# Altium project TDII_PROYECT_R00.PrjPcb
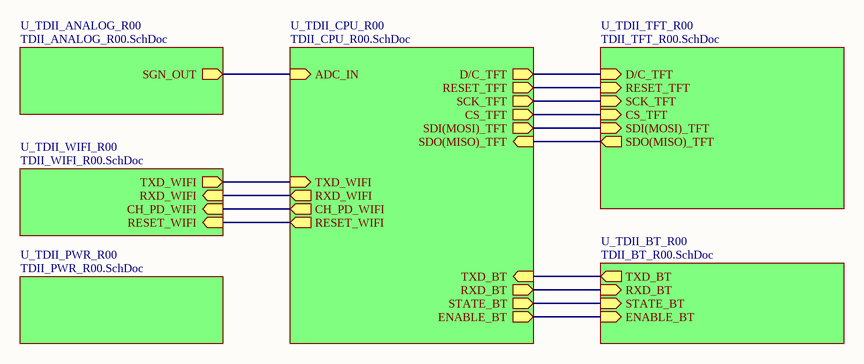
[diagram p0: TDII_Bloques_R00.SchDoc]
7 sheets, 73 parts. Net scope: hierarchical (ports join the sheet entries above them; power ports are global).
Board file: TDII_PCB_R00.PcbDoc
Sheets:
  TDII_Bloques_R00.SchDoc
    U_TDII_ANALOG_R00 = TDII_ANALOG_R00.SchDoc
    U_TDII_BT_R00 = TDII_BT_R00.SchDoc
    U_TDII_TFT_R00 = TDII_TFT_R00.SchDoc
    U_TDII_WIFI_R00 = TDII_WIFI_R00.SchDoc
    U_TDII_CPU_R00 = TDII_CPU_R00.SchDoc
    U_TDII_PWR_R00 = TDII_PWR_R00.SchDoc

## Sheet TDII_Bloques_R00.SchDoc
size A4

### Sub-sheets
U_TDII_ANALOG_R00 = TDII_ANALOG_R00.SchDoc: SGN_OUT (out)
U_TDII_BT_R00 = TDII_BT_R00.SchDoc: STATE_BT (in), RXD_BT (in), TXD_BT (out), ENABLE_BT (in)
U_TDII_CPU_R00 = TDII_CPU_R00.SchDoc: SCK_TFT (out), D/C_TFT (out), RESET_TFT (out), CS_TFT (out), SDO(MISO)_TFT (in), SDI(MOSI)_TFT (out), TXD_WIFI (in), RXD_WIFI (out), CH_PD_WIFI (out), RESET_WIFI (out), STATE_BT (out), TXD_BT (in), RXD_BT (out), ENABLE_BT (out), ADC_IN (in)
U_TDII_PWR_R00 = TDII_PWR_R00.SchDoc: no entries
U_TDII_TFT_R00 = TDII_TFT_R00.SchDoc: D/C_TFT (in), RESET_TFT (in), SCK_TFT (in), CS_TFT (in), SDO(MISO)_TFT (out), SDI(MOSI)_TFT (in)
U_TDII_WIFI_R00 = TDII_WIFI_R00.SchDoc: RXD_WIFI (in), TXD_WIFI (out), CH_PD_WIFI (in), RESET_WIFI (in)

### Nets
CS: sheet U_TDII_TFT_R00/CS_TFT, sheet U_TDII_CPU_R00/CS_TFT
D/C: sheet U_TDII_TFT_R00/D/C_TFT, sheet U_TDII_CPU_R00/D/C_TFT
MISO: sheet U_TDII_TFT_R00/SDO(MISO)_TFT, sheet U_TDII_CPU_R00/SDO(MISO)_TFT
MOSI: sheet U_TDII_TFT_R00/SDI(MOSI)_TFT, sheet U_TDII_CPU_R00/SDI(MOSI)_TFT
RESET: sheet U_TDII_TFT_R00/RESET_TFT, sheet U_TDII_CPU_R00/RESET_TFT
RX2_BT: sheet U_TDII_BT_R00/RXD_BT, sheet U_TDII_CPU_R00/RXD_BT
RX2_CPU: sheet U_TDII_WIFI_R00/TXD_WIFI, sheet U_TDII_CPU_R00/TXD_WIFI
RX2_WIFI: sheet U_TDII_WIFI_R00/RXD_WIFI, sheet U_TDII_CPU_R00/RXD_WIFI
RX3_CPU: sheet U_TDII_BT_R00/TXD_BT, sheet U_TDII_CPU_R00/TXD_BT
SCK: sheet U_TDII_TFT_R00/SCK_TFT, sheet U_TDII_CPU_R00/SCK_TFT
NetJ2_1: sheet U_TDII_BT_R00/ENABLE_BT, sheet U_TDII_CPU_R00/ENABLE_BT
NetJ2_6: sheet U_TDII_BT_R00/STATE_BT, sheet U_TDII_CPU_R00/STATE_BT
NetJ8_2: sheet U_TDII_WIFI_R00/CH_PD_WIFI, sheet U_TDII_CPU_R00/CH_PD_WIFI
NetJ8_3: sheet U_TDII_WIFI_R00/RESET_WIFI, sheet U_TDII_CPU_R00/RESET_WIFI
NetU2_1: sheet U_TDII_ANALOG_R00/SGN_OUT, sheet U_TDII_CPU_R00/ADC_IN

## Sheet TDII_ANALOG_R00.SchDoc
size A4
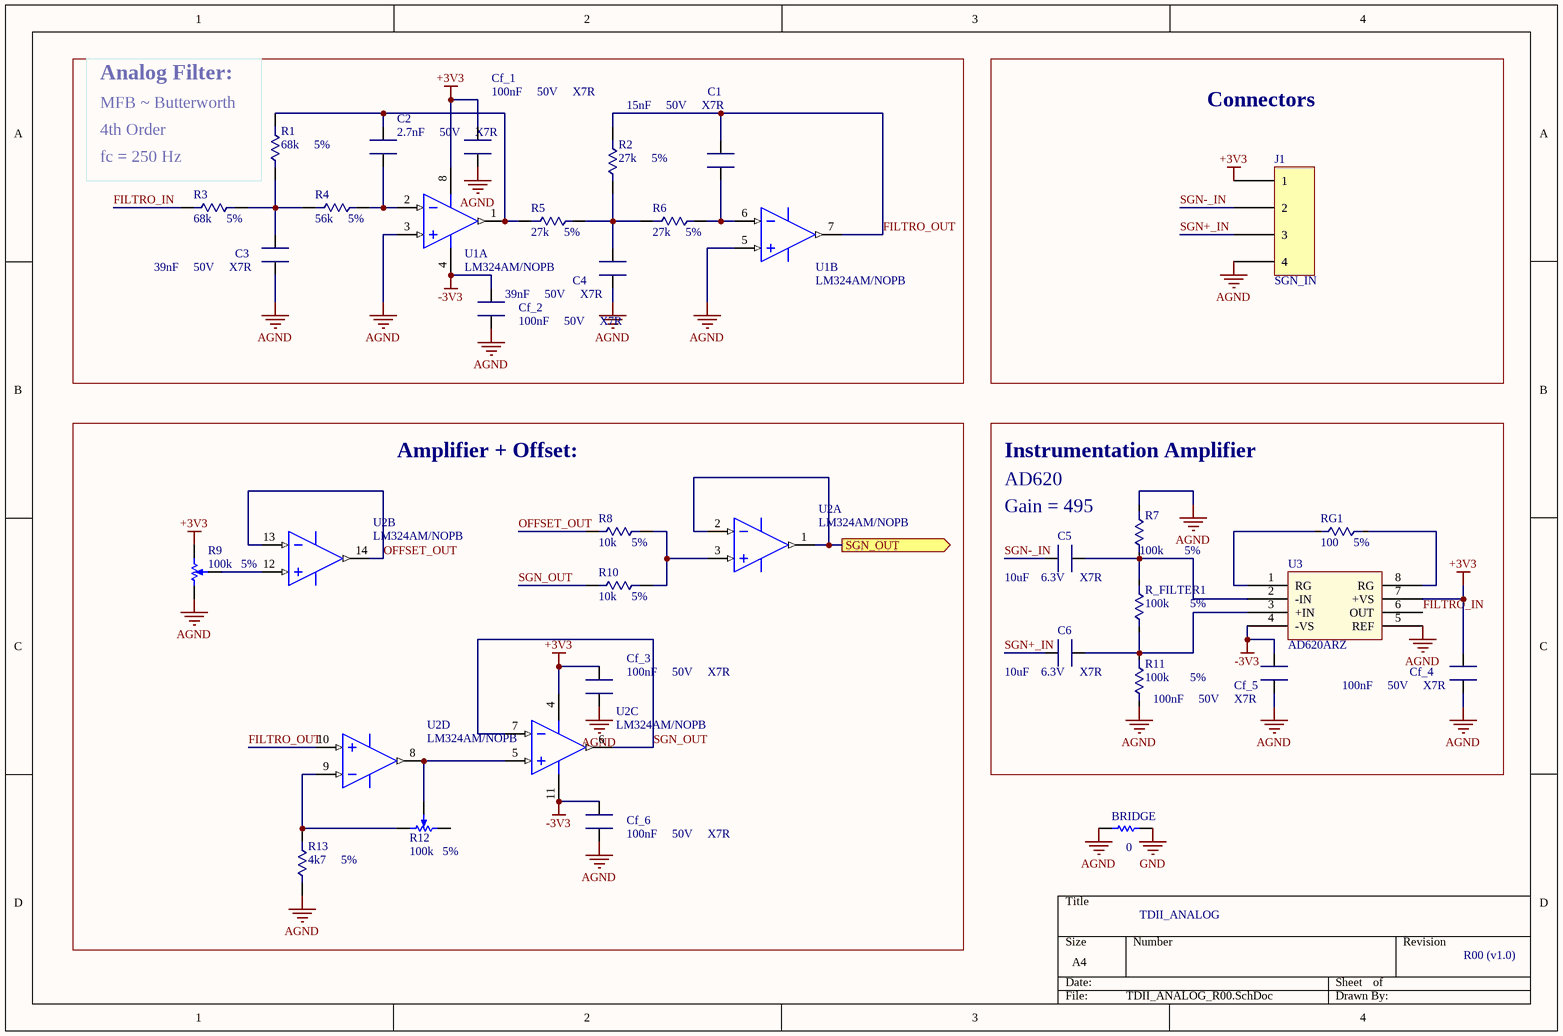
[diagram p1: TDII_ANALOG_R00.SchDoc]

### Parts
BRIDGE  value 0  [R_0805]  (hidden comment: Res1)
C1  15nF     50V     X7R  [C_0805]
C2  2.7nF     50V     X7R  [C_0805]
C3  39nF     50V     X7R  [C_0805]
C4  39nF     50V     X7R  [C_0805]
C5  10uF    6.3V     X7R  [C_0805]
C6  10uF    6.3V     X7R  [C_0805]
Cf_1  100nF     50V     X7R  [C_0805]
Cf_2  100nF     50V     X7R  [C_0805]
Cf_3  100nF     50V     X7R  [C_0805]
Cf_4  100nF     50V     X7R  [C_0805]
Cf_5  100nF     50V     X7R  [C_0805]
Cf_6  100nF     50V     X7R  [C_0805]
J1  SGN_IN  [HEADER_1X4]
R1  68k     5%  [R_0805]
R2  27k     5%  [R_0805]
R3  68k     5%  [R_0805]
R4  56k     5%  [R_0805]
R5  27k     5%  [R_0805]
R6  27k     5%  [R_0805]
R7  100k       5%  [R_0805]
R8  10k     5%  [R_0805]
R9  100k   5%  [Preset]
R10  10k     5%  [R_0805]
R11  100k       5%  [R_0805]
R12  100k   5%  [Preset]
R13  4k7     5%  [R_0805]
R_FILTER1  100k       5%  [R_0805]
RG1  100     5%  [R_0805]
U1  LM324AM/NOPB  [SOI8]  (parts A,B of 2)
U2  LM324AM/NOPB  [SOIC14]  (parts A,B,C,D of 4)
U3  AD620ARZ  [SOI8]

### Blocks framed on the sheet
Analog Filter:: C1-C4 Cf_1 Cf_2 R1-R6 U1
Connectors: J1
Amplifier + Offset:: Cf_3 Cf_6 R8-R10 R12 R13 U2
Instrumentation Amplifier: C5 C6 Cf_4 Cf_5 R7 R11 R_FILTER1 RG1 U3

### Ports
SGN_OUT (out)

### Nets
+3V3: Cf_1.2 Cf_3.2 Cf_4.2 J1.1 R9.2 U1.8(V+) U2.4(V+) U3.7(+VS)
-3V3: Cf_2.2 Cf_5.1 Cf_6.2 U1.4(GND) U2.11(GND) U3.4(-VS)
AGND: BRIDGE.1 C3.1 C4.1 Cf_1.1 Cf_2.1 Cf_3.1 Cf_4.1 Cf_5.2 Cf_6.1 J1.4 R7.2 R9.1 R11.1 R13.1 U1.3(INA+) U1.5(INB+) U3.5(REF)
GND: BRIDGE.2
FILTRO_IN: R3.1 U3.6(OUT)
FILTRO_OUT: C1.2 R2.2 U1.7(OUTB) U2.10(IN3+)
OFFSET_OUT: R8.1 U2.13(IN4-) U2.14(OUT4)
SGN+_IN: C6.1 J1.3
SGN-_IN: C5.1 J1.2
SGN_OUT: R10.1 U2.6(IN2-) U2.7(OUT2)
NetC1_1: C1.1 R6.1 U1.6(INB-)
NetC2_1: C2.1 R4.1 U1.2(INA-)
NetC2_2: C2.2 R1.2 R5.2 U1.1(OUTA)
NetC3_2: C3.2 R1.1 R3.2 R4.2
NetC4_2: C4.2 R2.1 R5.1 R6.2
NetC5_2: C5.2 R7.1 R_FILTER1.2 U3.2(-IN)
NetC6_2: C6.2 R11.2 R_FILTER1.1 U3.3(+IN)
NetR8_2: R8.2 R10.2 U2.3(IN1+)
NetR9_3: R9.3 U2.12(IN4+)
NetR12_1: R12.1 R13.2 U2.9(IN3-)
NetR12_3: R12.3 U2.5(IN2+) U2.8(OUT3)
NetRG1_1: RG1.1 U3.1(RG)
NetRG1_2: RG1.2 U3.8(RG)
NetU2_1: U2.1(OUT1) U2.2(IN1-) ; port SGN_OUT

Not connected (* = marked no-connect by the designer): R12 2

### Notes on the sheet
- (near R1) MFB ~ Butterworth
- 4th Order
- (near R3) fc = 250 Hz
- Gain = 495
- AD620
- TDII_ANALOG
- R00 (v1.0)

### Library data of the parts
BRIDGE = Res1: Resistor; Published: 8-Jun-2000; LatestRevisionDate: 17-Jul-2002; LatestRevisionNote: Re-released for DXP Platform.; PackageReference: AXIAL-0.3; Publisher: Altium Limited
C1-C6 Cf_1-Cf_6 = CAP
J1 = Conector_4 ( 0.100")
R1-R8 R10 R11 R13 R_FILTER1 RG1 = RES
R9 R12 = RPot SM: Square Trimming Potentiometer; Published: 17-Dec-2003; DatasheetVersion: Oct-2003; PackageReference: POT4MM-2; Publisher: Altium Limited; ComponentLink1Description: Manufacturer Link; ComponentLink1URL: http://bourns.com/2/search.html
U1 = LM358M: Low Power Dual Operational Amplifier, 8-pin Narrow SOIC; Manufacturer: National Semiconductor; PackageTopMarking: NSZXTT*LM*358M; PowerWise: N; CompType: Amplifiers; High-Reliability: Y; DatasheetVersion: Oct-2005; PackageVersion: revM, May-2009; PackageReference: M08A; PackageDescription: SOIC Narrow, 4.9 x 3.9 x 1.45mm, 8 Lead, 1.27mm Pitch; PartNumber: LM358M; RoHS: N; PinCount: 8; Code_JEDEC: MS-012-AA; Code_IPC: SOIC127P600-8; ComponentLink1Description: Manufacturer URL; ComponentLink1URL: http://www.national.com/; ComponentLink2Description: LM358 Datasheet; ComponentLink2URL: http://www.national.com/ds/LM/LM358.pdf; ComponentLink3Description: LM358 Web Page; ComponentLink3URL: http://www.national.com/pf/LM/LM358.html; ComponentLink4Description: M08A Package Page; ComponentLink4URL: http://www.national.com/packaging/folders/m08a.html; Digi-Key Part Number: LM358MXFSCT-ND
U2 = LM324M: Low Power Quad Operational Amplifier, 14-pin Narrow SOIC; Manufacturer: National Semiconductor; PackageTopMarking: NSUZXYTTE#*LM324M; PowerWise: N; CompType: Amplifiers; High-Reliability: Y; DatasheetVersion: Aug-2000; PackageVersion: revJ, Jan-1996; PackageReference: M14A; PackageDescription: Molded Package S.O., .150in Wide, 14 Lead; PartNumber: LM324M; RoHS: N; PinCount: 14; Code_JEDEC: MS-012AB; Code_IPC: SOIC127P600-14; ComponentLink1Description: Manufacturer URL; ComponentLink1URL: http://www.national.com/; ComponentLink2Description: LM324 Datasheet; ComponentLink2URL: http://www.national.com/ds/LM/LM324.pdf; ComponentLink3Description: LM324 Web Page; ComponentLink3URL: http://www.national.com/pf/LM/LM324.html; ComponentLink4Description: M14A Package Page; ComponentLink4URL: http://www.national.com/packaging/folders/m14a.html
U3 = AD620: Digi-Key Part Number: AD620ARZ-REEL7TR-ND

## Sheet TDII_BT_R00.SchDoc
size A4
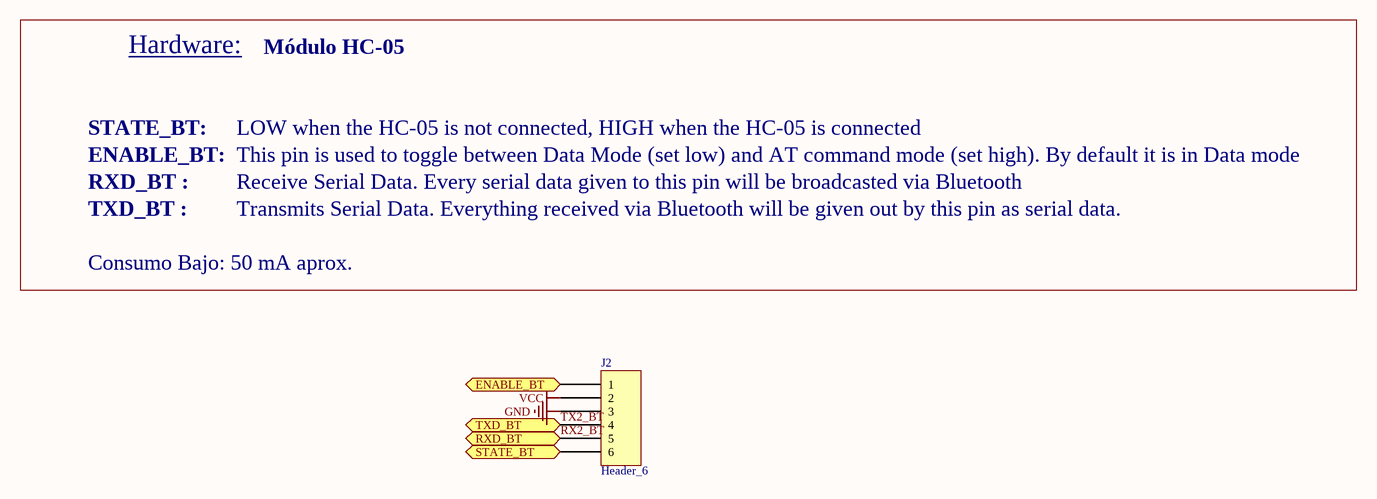
[diagram p2: TDII_BT_R00.SchDoc]

### Parts
J2  Header_6  [HEADER_1x6]

### Ports
ENABLE_BT (in), RXD_BT (out), STATE_BT (out), TXD_BT (in)

### Nets
GND: J2.3
VCC: J2.2
RX2_BT: J2.5 ; port RXD_BT
TX2_BT: J2.4 ; port TXD_BT  [project net RX3_CPU]
NetJ2_1: J2.1 ; port ENABLE_BT
NetJ2_6: J2.6 ; port STATE_BT

### Notes on the sheet
- Hardware:
- Módulo HC-05
- ENABLE_BT:
- STATE_BT:
- RXD_BT :
- LOW when the HC-05 is not connected, HIGH when the HC-05 is connected
- This pin is used to toggle between Data Mode (set low) and AT command mode (set high). By default it is in Data mode
- Receive Serial Data. Every serial data given to this pin will be broadcasted via Bluetooth
- TXD_BT :
- Transmits Serial Data. Everything received via Bluetooth will be given out by this pin as serial data.
- Consumo Bajo: 50 mA aprox.

### Library data of the parts
J2 = Conector_6 ( 0.100¨)

## Sheet TDII_TFT_R00.SchDoc
size A4
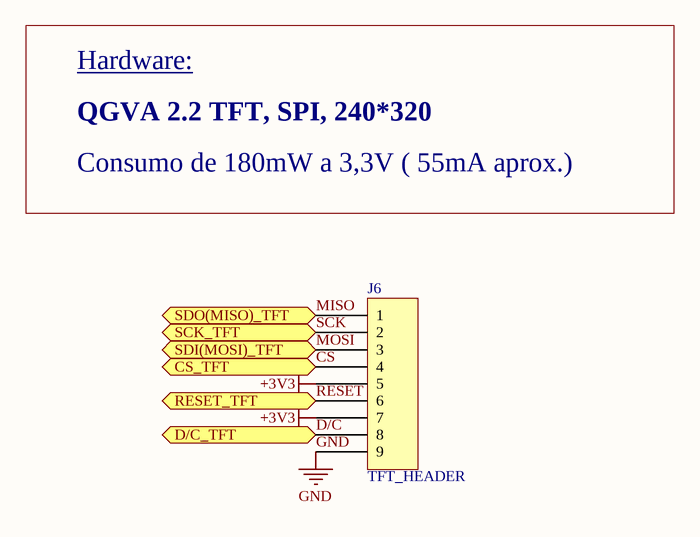
[diagram p3: TDII_TFT_R00.SchDoc]

### Parts
J6  TFT_HEADER  [Conector_TFT]

### Ports
CS_TFT (in), D/C_TFT (in), RESET_TFT (in), SCK_TFT (in), SDI(MOSI)_TFT (in), SDO(MISO)_TFT (out)

### Nets
+3V3: J6.5 J6.7
GND: J6.9
CS: J6.4 ; port CS_TFT
D/C: J6.8 ; port D/C_TFT
MISO: J6.1 ; port SDO(MISO)_TFT
MOSI: J6.3 ; port SDI(MOSI)_TFT
RESET: J6.6 ; port RESET_TFT
SCK: J6.2 ; port SCK_TFT

### Notes on the sheet
- Hardware:
- QGVA 2.2 TFT, SPI, 240*320
- Consumo de 180mW a 3,3V ( 55mA aprox.)

### Library data of the parts
J6 = Conector_9 (0.100¨)

## Sheet TDII_WIFI_R00.SchDoc
size A4
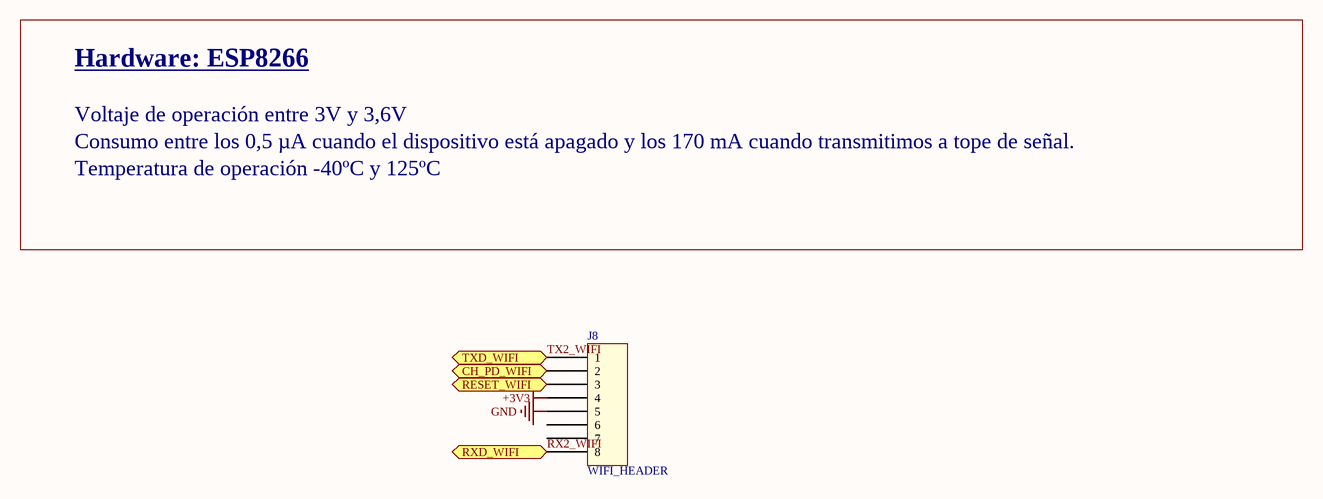
[diagram p4: TDII_WIFI_R00.SchDoc]

### Parts
J8  WIFI_HEADER  [Header_WIFI]

### Ports
CH_PD_WIFI (in), RESET_WIFI (in), RXD_WIFI (in), TXD_WIFI (out)

### Nets
+3V3: J8.4
GND: J8.5
RX2_WIFI: J8.8 ; port RXD_WIFI
TX2_WIFI: J8.1 ; port TXD_WIFI  [project net RX2_CPU]
NetJ8_2: J8.2 ; port CH_PD_WIFI
NetJ8_3: J8.3 ; port RESET_WIFI

Not connected (* = marked no-connect by the designer): J8 6 7

### Notes on the sheet
- Hardware: ESP8266
- Voltaje de operación entre 3V y 3,6V
- Consumo entre los 0,5 µA cuando el dispositivo está apagado y los 170 mA cuando transmitimos a tope de señal.
- Temperatura de operación -40ºC y 125ºC

### Library data of the parts
J8 = Conector_8 ( 0.100¨)

## Sheet TDII_CPU_R00.SchDoc: TDII_CPU_LPC
size B; Revision: R0.0
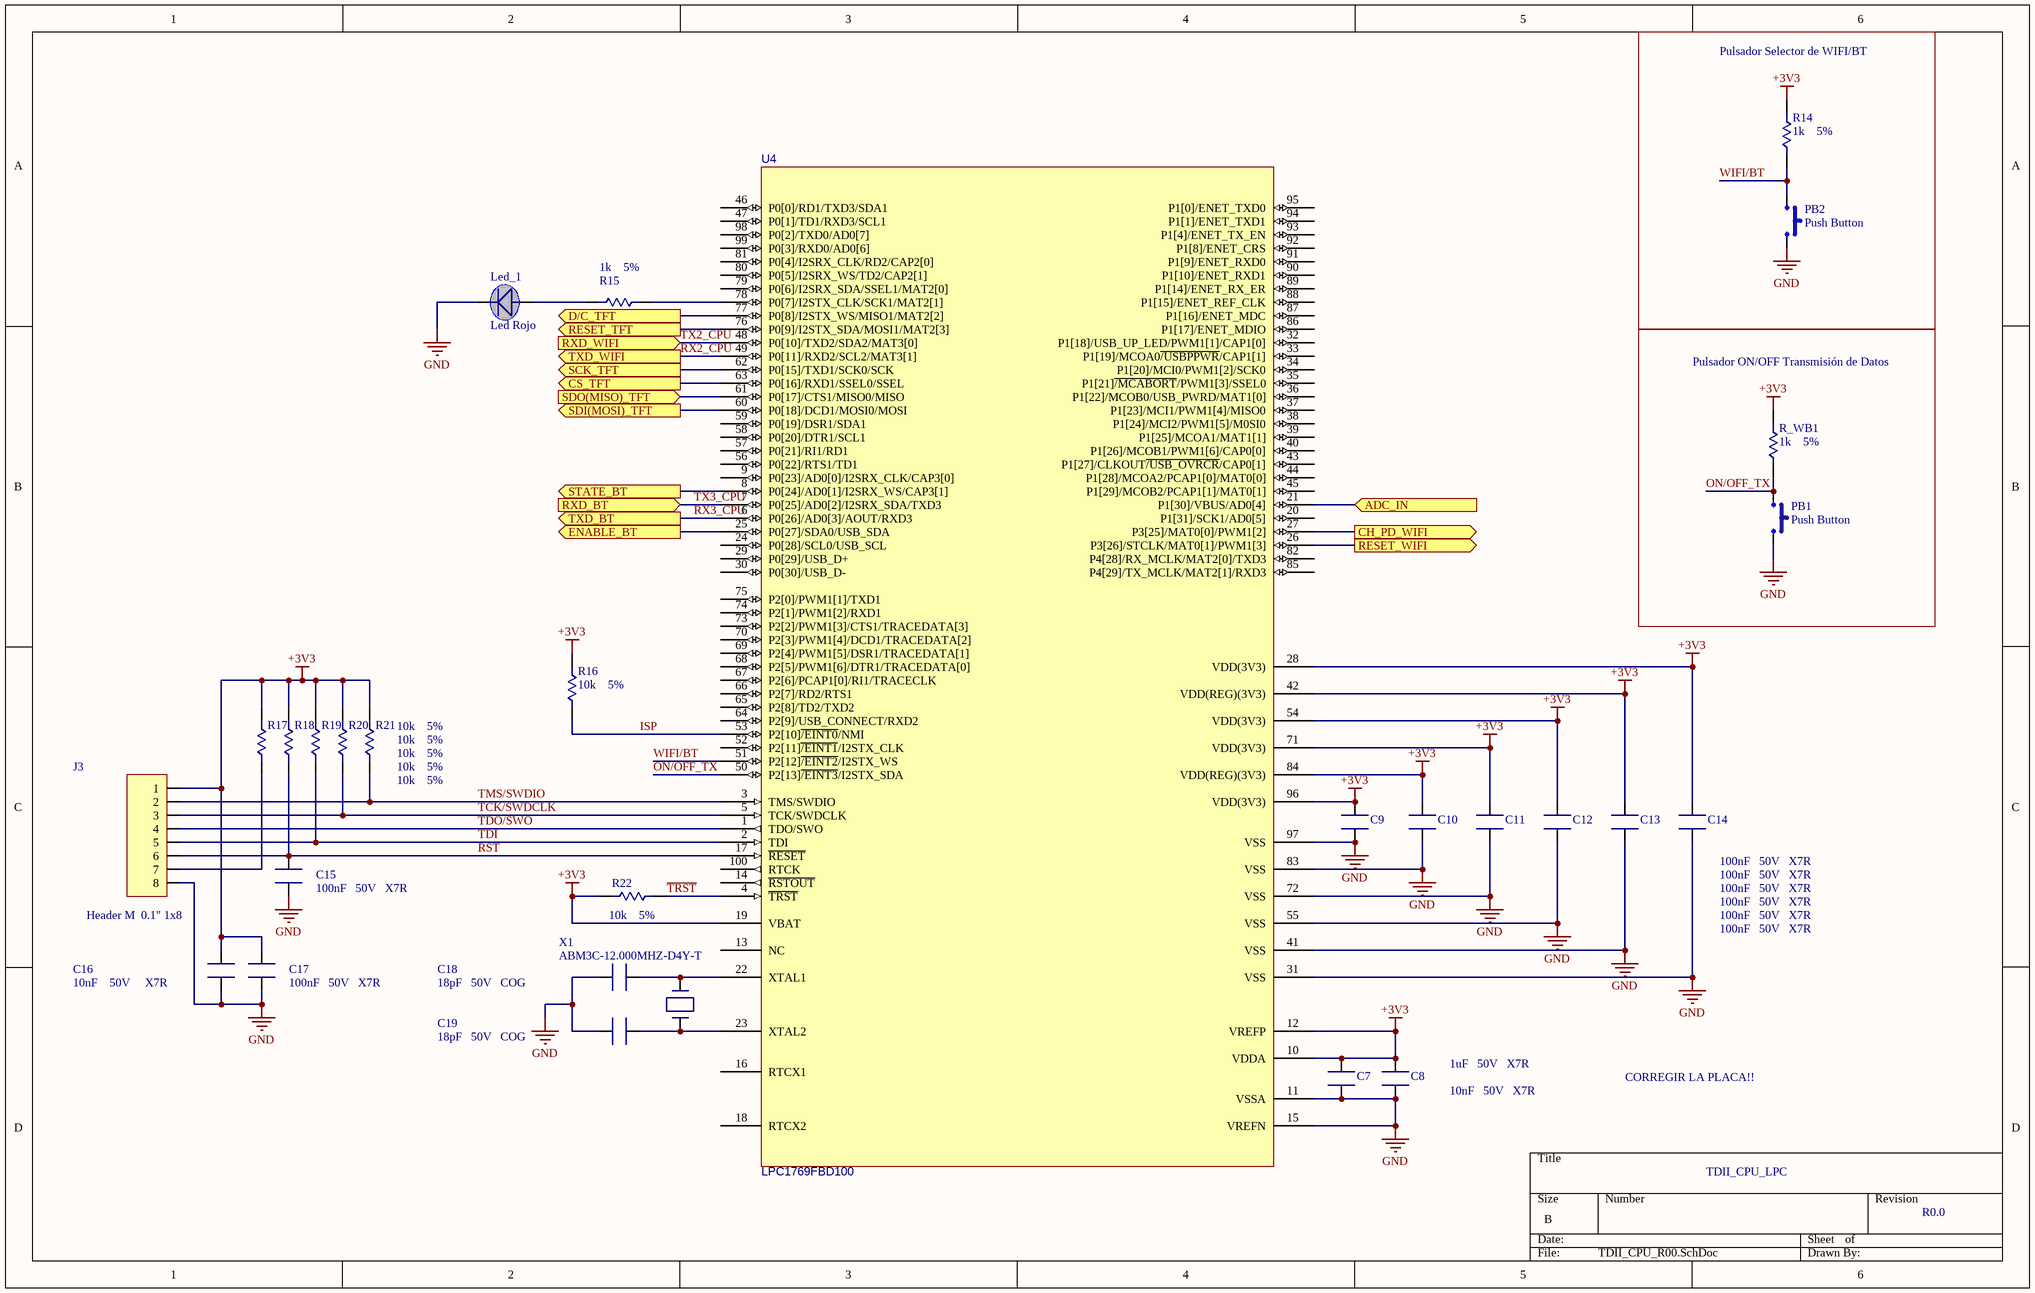
[diagram p5: TDII_CPU_R00.SchDoc]

### Parts
C7  10nF   50V   X7R  [C_0805]
C8  1uF   50V   X7R  [C_0805]
C9  100nF   50V   X7R  [C_0805]
C10  100nF   50V   X7R  [C_0805]
C11  100nF   50V   X7R  [C_0805]
C12  100nF   50V   X7R  [C_0805]
C13  100nF   50V   X7R  [C_0805]
C14  100nF   50V   X7R  [C_0805]
C15  100nF   50V   X7R  [C_0805]
C16  10nF    50V     X7R  [C_0805]
C17  100nF   50V   X7R  [C_0805]
C18  18pF   50V   COG  [C_0805]
C19  18pF   50V   COG  [C_0805]
J3  Header M  0.1" 1x8  [Header_THT]
Led_1  Led Rojo  [LED_0805]
PB1  Push Button  [HEADER_1x2]
PB2  Push Button  [HEADER_1x2]
R14  1k    5%  [R_0805]
R15  1k    5%  [R_0805]
R16  10k    5%  [R_0805]
R17  10k    5%  [R_0805]
R18  10k    5%  [R_0805]
R19  10k    5%  [R_0805]
R20  10k    5%  [R_0805]
R21  10k    5%  [R_0805]
R22  10k    5%  [R_0805]
R_WB1  1k    5%  [R_0805]
U4  LPC1769FBD100  [LQFP100]
X1  ABM3C-12.000MHZ-D4Y-T  [ABM3C]

### Blocks framed on the sheet
Pulsador Selector de WIFI/BT: PB2 R14
Pulsador ON/OFF Transmisión de Datos: PB1 R_WB1

### Ports
ADC_IN (in), CH_PD_WIFI (out), CS_TFT (out), D/C_TFT (out), ENABLE_BT (out), RESET_TFT (out), RESET_WIFI (out), RXD_BT (in), RXD_WIFI (in), SCK_TFT (out), SDI(MOSI)_TFT (out), SDO(MISO)_TFT (in), STATE_BT (out), TXD_BT (out), TXD_WIFI (out)

### Nets
+3V3: C7.1 C8.1 C9.1 C10.1 C11.1 C12.1 C13.1 C14.1 C16.1 C17.1 J3.1 R14.2 R16.2 R17.2 R18.2 R19.2 R20.2 R21.2 R22.1 R_WB1.2 U4.10(VDDA) U4.12(VREFP) U4.19(VBAT) U4.28(VDD(3V3)) U4.42(VDD(REG)(3V3)) U4.54(VDD(3V3)) U4.71(VDD(3V3)) U4.84(VDD(REG)(3V3)) U4.96(VDD(3V3))
GND: C7.2 C8.2 C9.2 C10.2 C11.2 C12.2 C13.2 C14.2 C15.2 C16.2 C17.2 C18.1 C19.1 J3.8 Led_1.2 PB1.2 PB2.2 U4.11(VSSA) U4.15(VREFN) U4.31(VSS) U4.41(VSS) U4.55(VSS) U4.72(VSS) U4.83(VSS) U4.97(VSS)
~{TRST}: R22.2 U4.4(~{TRST})
CS: U4.63(P0[16]/RXD1/SSEL0/SSEL) ; port CS_TFT
D/C: U4.77(P0[8]/I2STX_WS/MISO1/MAT2[2]) ; port D/C_TFT
ISP: R16.1 U4.53(P2[10]~{/EINT0}/NMI)
MISO: U4.61(P0[17]/CTS1/MISO0/MISO) ; port SDO(MISO)_TFT
MOSI: U4.60(P0[18]/DCD1/MOSI0/MOSI) ; port SDI(MOSI)_TFT
ON/OFF_TX: PB1.1 R_WB1.1 U4.50(P2[13]~{/EINT3}/I2STX_SDA)
RESET: U4.76(P0[9]/I2STX_SDA/MOSI1/MAT2[3]) ; port RESET_TFT
RST: C15.1 J3.6 R18.1 U4.17(~{RESET})
RX2_CPU: U4.49(P0[11]/RXD2/SCL2/MAT3[1]) ; port TXD_WIFI
RX3_CPU: U4.6(P0[26]/AD0[3]/AOUT/RXD3) ; port TXD_BT
SCK: U4.62(P0[15]/TXD1/SCK0/SCK) ; port SCK_TFT
TCK/SWDCLK: J3.3 R20.1 U4.5(TCK/SWDCLK)
TDI: J3.5 R19.1 U4.2(TDI)
TDO/SWO: J3.4 U4.1(TDO/SWO)
TMS/SWDIO: J3.2 R21.1 U4.3(TMS/SWDIO)
TX2_CPU: U4.48(P0[10]/TXD2/SDA2/MAT3[0]) ; port RXD_WIFI  [project net RX2_WIFI]
TX3_CPU: U4.7(P0[25]/AD0[2]/I2SRX_SDA/TXD3) ; port RXD_BT  [project net RX2_BT]
WIFI/BT: PB2.1 R14.1 U4.51(P2[12]~{/EINT2}/I2STX_WS)
NetC18_2: C18.2 U4.22(XTAL1) X1.1
NetC19_2: C19.2 U4.23(XTAL2) X1.3
NetJ2_1: U4.25(P0[27]/SDA0/USB_SDA) ; port ENABLE_BT
NetJ2_6: U4.8(P0[24]/AD0[1]/I2SRX_WS/CAP3[1]) ; port STATE_BT
NetJ3_7: J3.7 R17.1
NetJ8_2: U4.27(P3[25]/MAT0[0]/PWM1[2]) ; port CH_PD_WIFI
NetJ8_3: U4.26(P3[26]/STCLK/MAT0[1]/PWM1[3]) ; port RESET_WIFI
NetLed_1_1: Led_1.1 R15.1
NetR15_2: R15.2 U4.78(P0[7]/I2STX_CLK/SCK1/MAT2[1])
NetU2_1: U4.21(P1[30]/VBUS/AD0[4]) ; port ADC_IN

Not connected (* = marked no-connect by the designer): U4 9(P0[23]/AD0[0]/I2SRX_CLK/CAP3[0]) 13(NC) 14(~{RSTOUT}) 16(RTCX1) 18(RTCX2) 20(P1[31]/SCK1/AD0[5]) 24(P0[28]/SCL0/USB_SCL) 29(P0[29]/USB_D+) 30(P0[30]/USB_D-) 32(P1[18]/USB_UP_LED/PWM1[1]/CAP1[0]) 33(P1[19]/MCOA0~{/USBPPWR}/CAP1[1]) 34(P1[20]/MCI0/PWM1[2]/SCK0) 35(P1[21]~{/MCABORT}/PWM1[3]/SSEL0) 36(P1[22]/MCOB0/USB_PWRD/MAT1[0]) 37(P1[23]/MCI1/PWM1[4]/MISO0) 38(P1[24]/MCI2/PWM1[5]/M0SI0) 39(P1[25]/MCOA1/MAT1[1]) 40(P1[26]/MCOB1/PWM1[6]/CAP0[0]) 43(P1[27]/CLKOUT~{/USB_OVRCR}/CAP0[1]) 44(P1[28]/MCOA2/PCAP1[0]/MAT0[0]) 45(P1[29]/MCOB2/PCAP1[1]/MAT0[1]) 46(P0[0]/RD1/TXD3/SDA1) 47(P0[1]/TD1/RXD3/SCL1) 52(P2[11]~{/EINT1}/I2STX_CLK) 56(P0[22]/RTS1/TD1) 57(P0[21]/RI1/RD1) 58(P0[20]/DTR1/SCL1) 59(P0[19]/DSR1/SDA1) 64(P2[9]/USB_CONNECT/RXD2) 65(P2[8]/TD2/TXD2) 66(P2[7]/RD2/RTS1) 67(P2[6]/PCAP1[0]/RI1/TRACECLK) 68(P2[5]/PWM1[6]/DTR1/TRACEDATA[0]) 69(P2[4]/PWM1[5]/DSR1/TRACEDATA[1]) 70(P2[3]/PWM1[4]/DCD1/TRACEDATA[2]) 73(P2[2]/PWM1[3]/CTS1/TRACEDATA[3]) 74(P2[1]/PWM1[2]/RXD1) 75(P2[0]/PWM1[1]/TXD1) 79(P0[6]/I2SRX_SDA/SSEL1/MAT2[0]) 80(P0[5]/I2SRX_WS/TD2/CAP2[1]) 81(P0[4]/I2SRX_CLK/RD2/CAP2[0]) 82(P4[28]/RX_MCLK/MAT2[0]/TXD3) 85(P4[29]/TX_MCLK/MAT2[1]/RXD3) 86(P1[17]/ENET_MDIO) 87(P1[16]/ENET_MDC) 88(P1[15]/ENET_REF_CLK) 89(P1[14]/ENET_RX_ER) 90(P1[10]/ENET_RXD1) 91(P1[9]/ENET_RXD0) 92(P1[8]/ENET_CRS) 93(P1[4]/ENET_TX_EN) 94(P1[1]/ENET_TXD1) 95(P1[0]/ENET_TXD0) 98(P0[2]/TXD0/AD0[7]) 99(P0[3]/RXD0/AD0[6]) 100(RTCK)

### Notes on the sheet
- CORREGIR LA PLACA!!

### Library data of the parts
C7-C19 = CAP
J3 = Header
Led_1 = LED
R14-R22 R_WB1 = RES
U4 = LPC1768FBD100: CPU Cortex M3; Digi-Key Part Number: 568-4966-ND
X1 = ABM3_CRISTAL: Digi-Key Part Number: 535-11281-1-ND

## Sheet TDII_PWR_R00.SchDoc
size A4
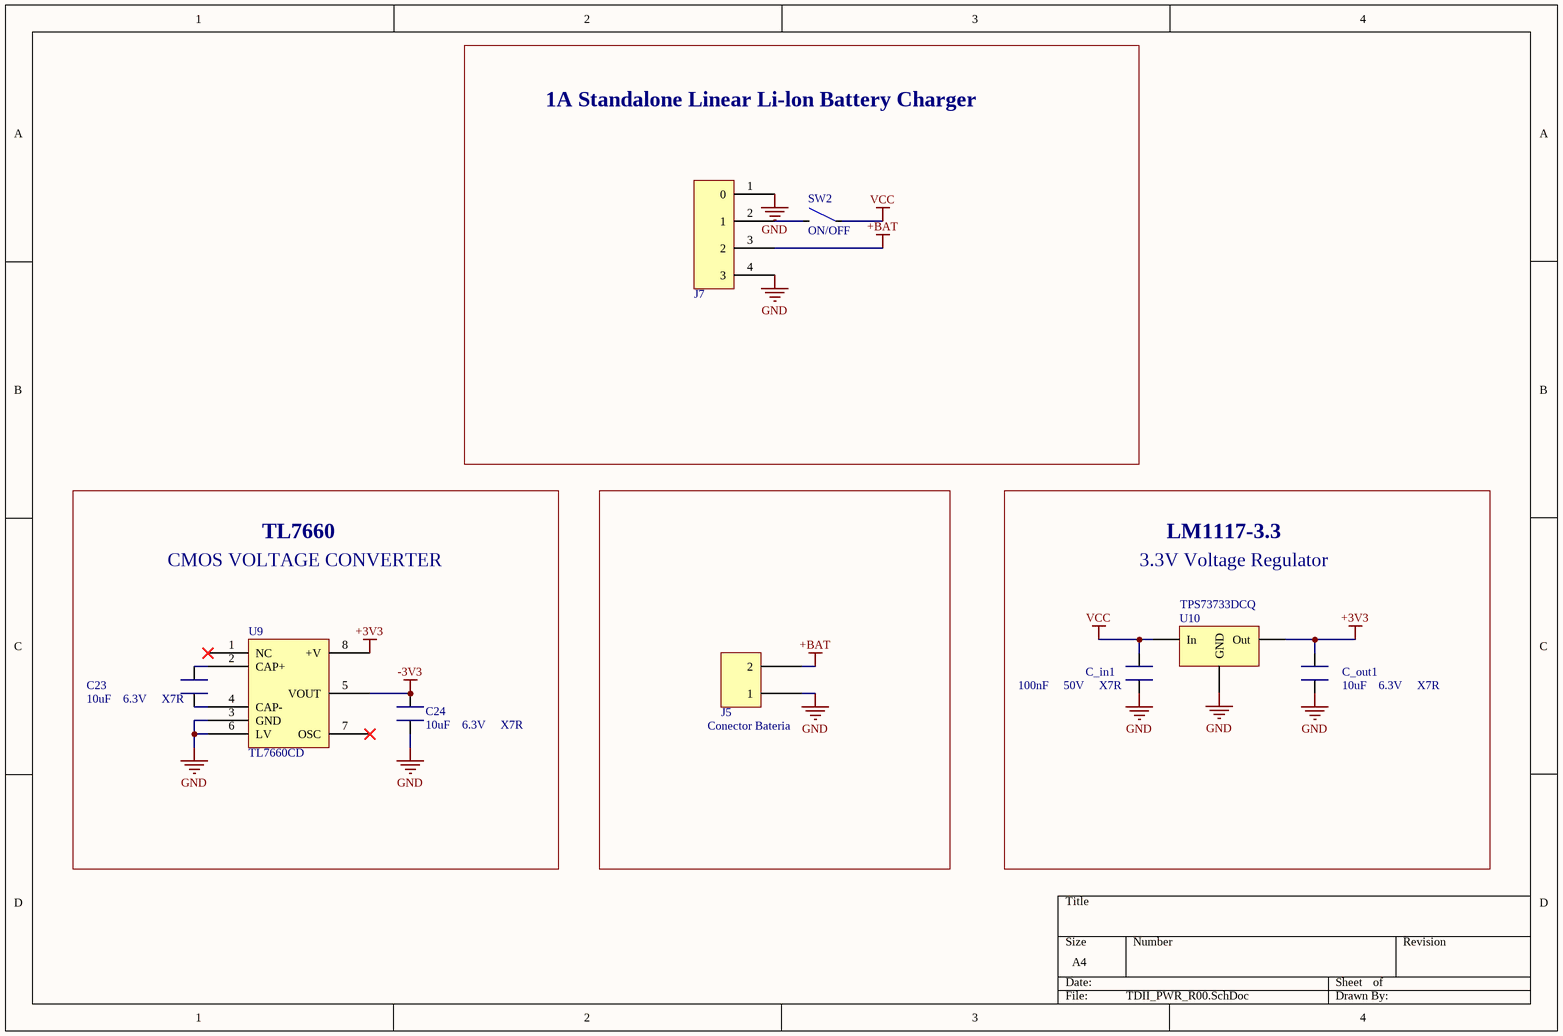
[diagram p6: TDII_PWR_R00.SchDoc]

### Parts
C23  10uF    6.3V     X7R  [C_0805]
C24  10uF    6.3V     X7R  [C_0805]
C_in1  100nF     50V     X7R  [C_0805]
C_out1  10uF    6.3V     X7R  [C_0805]
J5  Conector Bateria  [HEADER_1x2]
J7  Conector 0.100" - 4 pines  [HEADER_CHARGER]  (value not drawn)
SW2  ON/OFF  [HEADER_1x2]
U9  TL7660CD  [SOI8]
U10  TPS73733DCQ  [SOT-223-4]

### Blocks framed on the sheet
1A Standalone Linear Li-lon Battery Charger: J7 SW2
TL7660: C23 C24 U9
LM1117-3.3: C_in1 C_out1 U10

### Nets
+3V3: C_out1.1 U9.8(+V) U10.2(Out)
+BAT: J5.1(2) J7.3(2)
-3V3: C24.1 U9.5(VOUT)
GND: C24.2 C_in1.2 C_out1.2 J5.2(1) J7.1(0) J7.4(3) U9.3(GND) U9.6(LV) U10.1(GND)
VCC: C_in1.1 SW2.2 U10.3(In)
NetC23_1: C23.1 U9.2(CAP+)
NetC23_2: C23.2 U9.4(CAP-)
NetJ7_2: J7.2(1) SW2.1

Not connected (* = marked no-connect by the designer): U9 1(NC)* 7(OSC)*

### Notes on the sheet
- CMOS VOLTAGE CONVERTER
- 3.3V Voltage Regulator

### Library data of the parts
C23 C24 C_in1 C_out1 = CAP
J5 = Conector_2 ( 0.100")
SW2 = SWITCH: Switch, generic
U9 = TL7660
U10 = TLV1117-33CKVURG3: LDO Voltage Regulators Sgl Output LDO 800mA Fixed Int Crnt limit; Manufacturer: Texas Instruments; Input Bias Current - Max: 5 mA; Input Voltage MAX: 15 V; Number of Outputs: 1 Output; Output Voltage: 3.3 V; Dropout Voltage - Max: 1.2 V at 100 mA, 1.25 V at 500 mA, 1.3 V at 800 mA; Input Voltage MIN: + 4.7 V; Line Regulation: 0.2 %; Load Regulation: 0.4 %; Supplier 1: Mouser; RoHS: RoHS Compliant; Category: LDO Voltage Regulators; Stock 1: 2731; Pricing 1: 1=0.624, 10=0.496, 100=0.370, 500=0.272, 1000=0.248, 2500=0.210, 10000=0.202 (EUR); Output Current: 800 mA; Output Type: Fixed; Package/Case: TO-252-3; Packaging: Reel; Series: TLV1117-33; Mounting Style: SMD/SMT; Maximum Operating Temperature: + 125 C; Minimum Operating Temperature: 0 C; Product Category: Regulators - Standard; Standard Pack Qty: 2500; RoHS - Mouser: Y; Minimum Order Quantity: 1; Reeling: True; ComponentLink1URL: http://www.ti.com/litv/slvs561k; ComponentLink1Description: http://www.ti.com/litv/slvs561k; Supplier Part Number 1: 595-TLV111733CKVURG3

## Nets that join several sheets
+3V3: TDII_ANALOG_R00 (8 pins), TDII_TFT_R00 (J6.5 J6.7), TDII_WIFI_R00 (J8.4), TDII_CPU_R00 (29 pins), TDII_PWR_R00 (C_out1.1 U9.8 U10.2)
-3V3: TDII_ANALOG_R00 (6 pins), TDII_PWR_R00 (C24.1 U9.5)
GND: TDII_ANALOG_R00 (BRIDGE.2), TDII_BT_R00 (J2.3), TDII_TFT_R00 (J6.9), TDII_WIFI_R00 (J8.5), TDII_CPU_R00 (25 pins), TDII_PWR_R00 (9 pins)
VCC: TDII_BT_R00 (J2.2), TDII_PWR_R00 (C_in1.1 SW2.2 U10.3)
CS: TDII_TFT_R00 (J6.4), TDII_CPU_R00 (U4.63)
D/C: TDII_TFT_R00 (J6.8), TDII_CPU_R00 (U4.77)
MISO: TDII_TFT_R00 (J6.1), TDII_CPU_R00 (U4.61)
MOSI: TDII_TFT_R00 (J6.3), TDII_CPU_R00 (U4.60)
NetJ2_1: TDII_BT_R00 (J2.1), TDII_CPU_R00 (U4.25)
NetJ2_6: TDII_BT_R00 (J2.6), TDII_CPU_R00 (U4.8)
NetJ8_2: TDII_WIFI_R00 (J8.2), TDII_CPU_R00 (U4.27)
NetJ8_3: TDII_WIFI_R00 (J8.3), TDII_CPU_R00 (U4.26)
NetU2_1: TDII_ANALOG_R00 (U2.1 U2.2), TDII_CPU_R00 (U4.21)
RESET: TDII_TFT_R00 (J6.6), TDII_CPU_R00 (U4.76)
RX2_BT: TDII_BT_R00 (J2.5), TDII_CPU_R00 (U4.7)
RX2_CPU: TDII_WIFI_R00 (J8.1), TDII_CPU_R00 (U4.49)
RX2_WIFI: TDII_WIFI_R00 (J8.8), TDII_CPU_R00 (U4.48)
RX3_CPU: TDII_BT_R00 (J2.4), TDII_CPU_R00 (U4.6)
SCK: TDII_TFT_R00 (J6.2), TDII_CPU_R00 (U4.62)